# EAGLE board main (EAGLE 5.11)
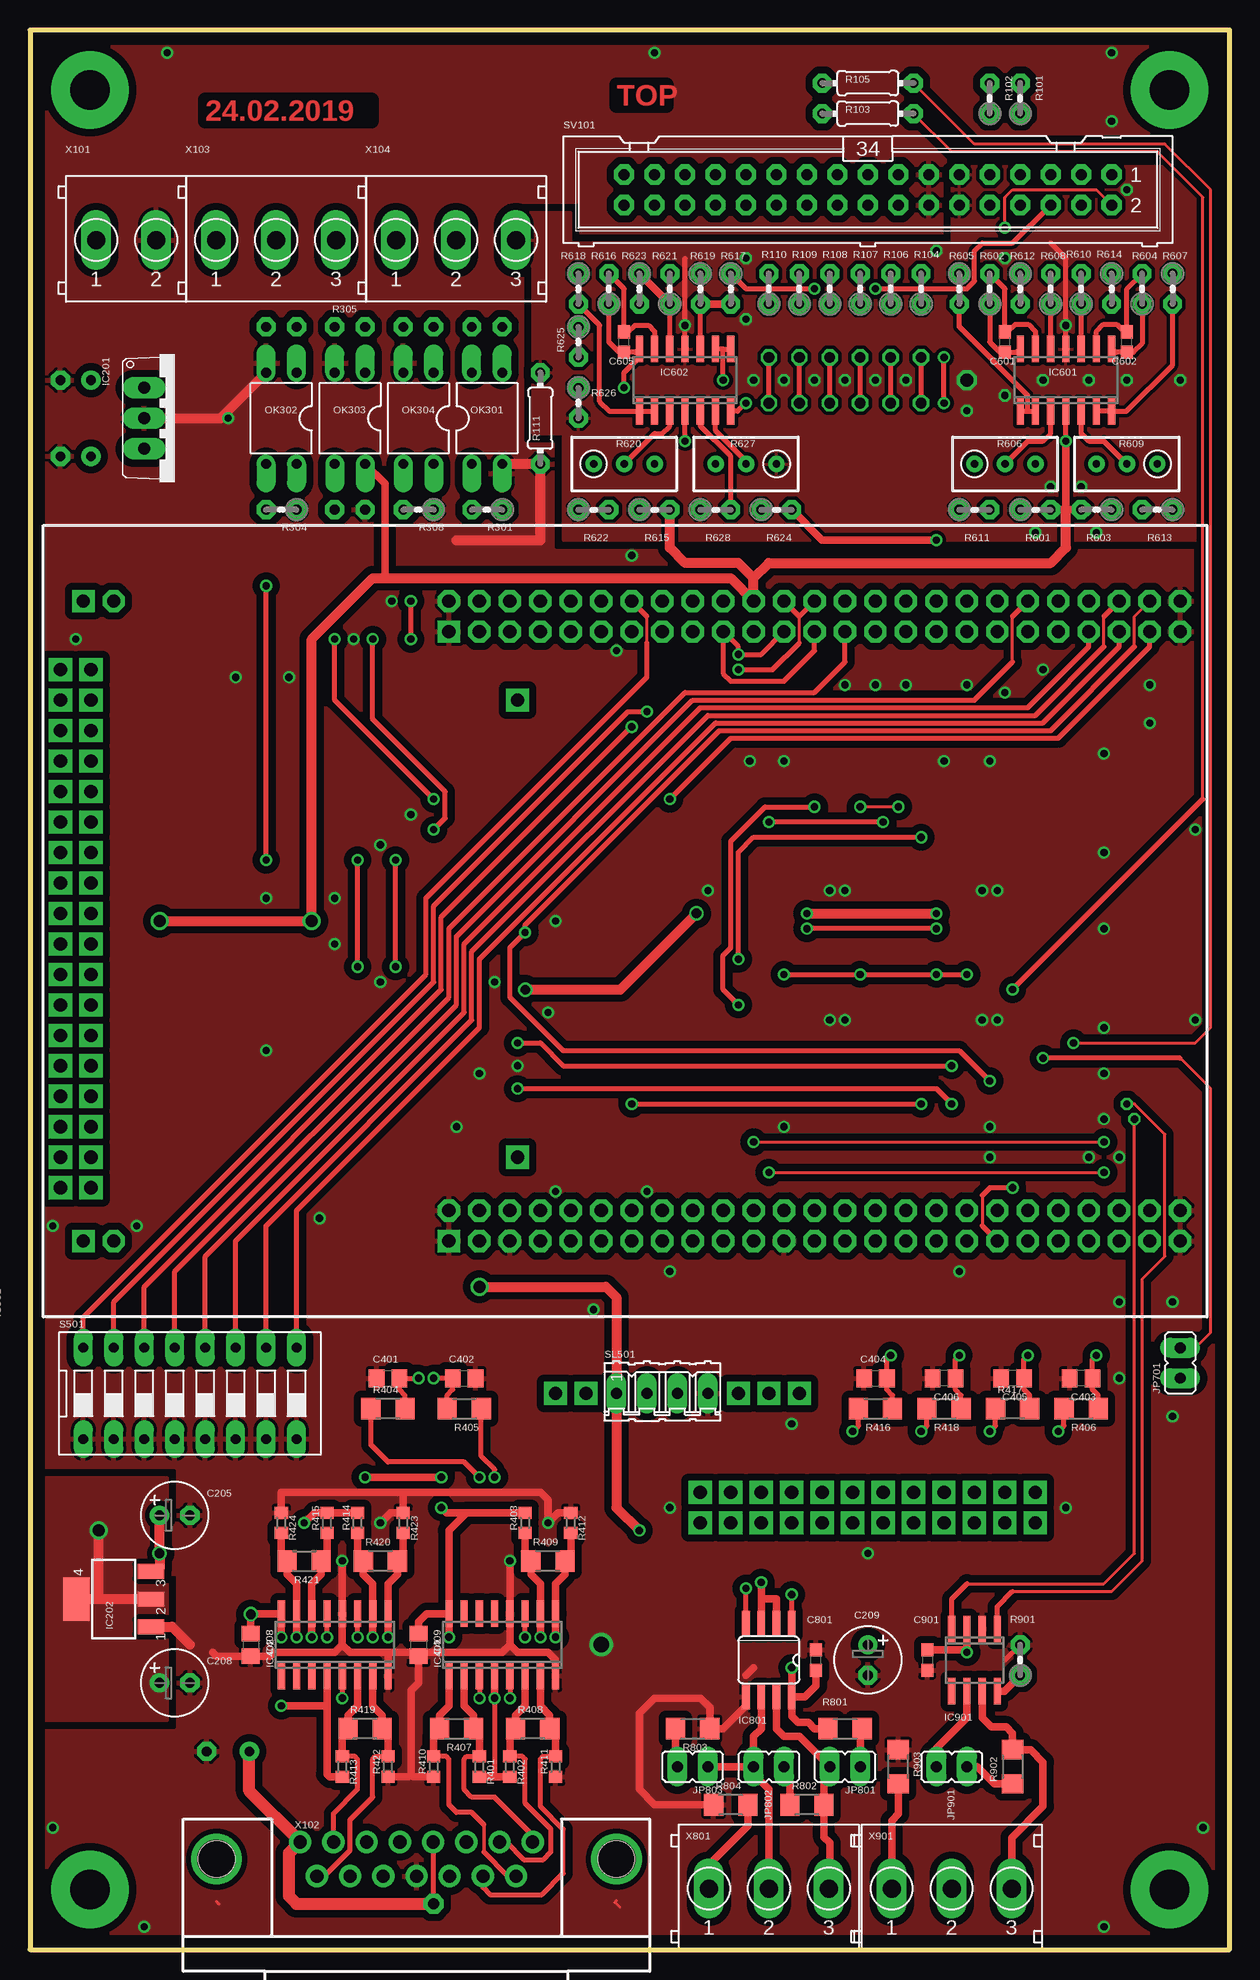
[diagram p9: board, top side]
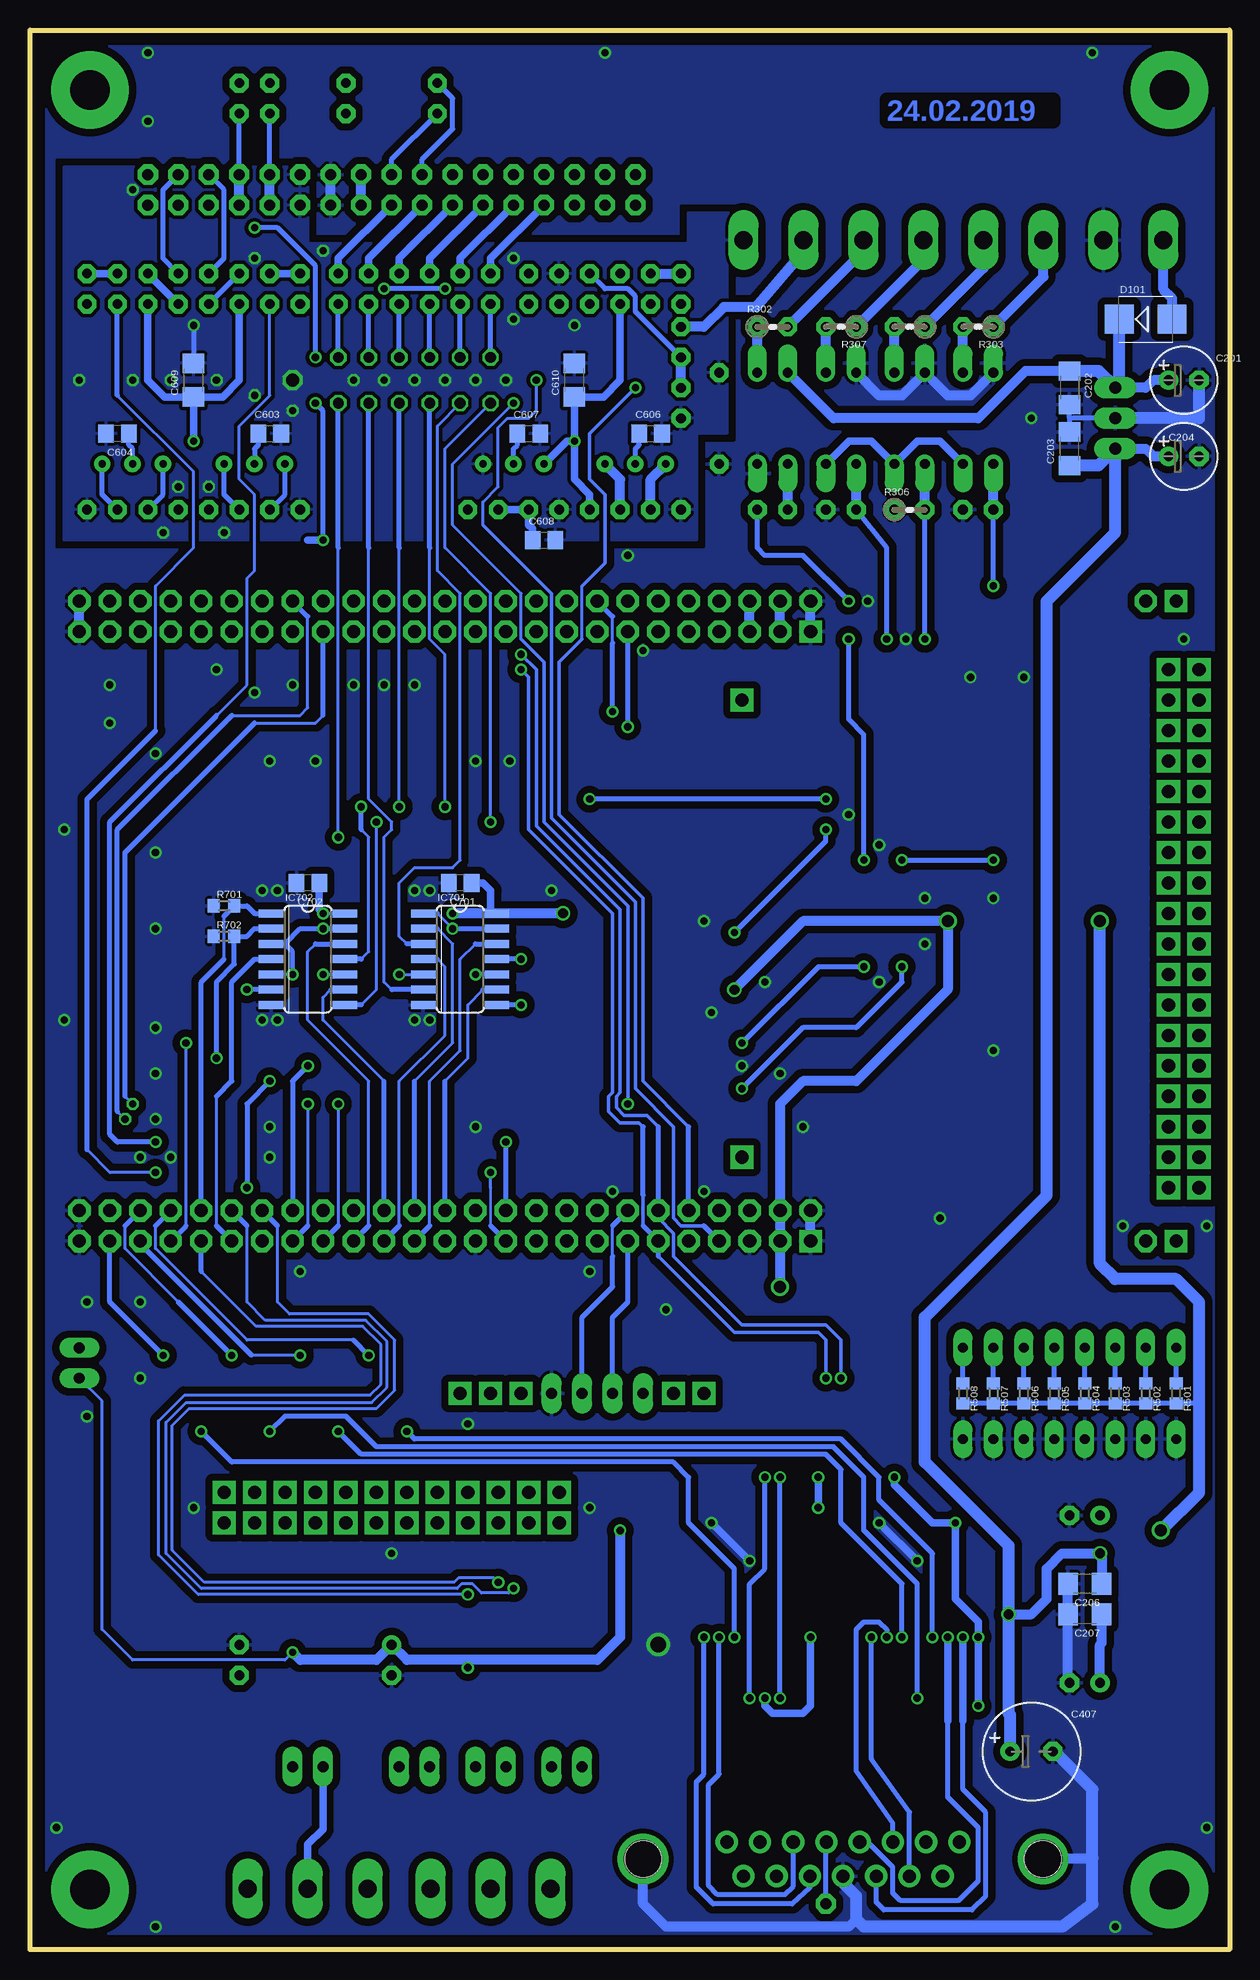
[diagram p10: board, bottom side, seen from below]

Size 100 x 160 mm. Coordinates in mm from the lower left corner, seen from the top.
Outline: 0,0 100,0 100,160 0,160 0,0
Copper layers (1*2*16): Top 0.035mm / dielectric 1.5mm / Route2 0.035mm / dielectric 0.15mm / Bottom 0.035mm
Design rules "default *": minimum track width 8mil, minimum drill 0.6mm, track to track 8mil, track to pad 8mil, pad to pad 8mil, via to via 8mil, smd to smd 8mil, copper to edge 40mil, drill to drill 8mil, minimum pad ring 15mil, minimum via ring 8mil, stop-mask expansion 4mil, vias tented up to drill 0mil, thermal gap 10mil

## Footprints (pad centres in the part's own frame; a part is rotated, then mirrored left to right if it is on the bottom)
E2,5-6 = drill 0.813 pad 1.6 round: + -1.27,0 | drill 0.813 pad 1.6 octagon: - 1.27,0
C1206 = smd 1.6 x 1.8: 1 -1.4,0; 2 1.4,0
C0805 = smd 1.3 x 1.5: 1 -0.95,0; 2 0.95,0
E3,5-8 = drill 0.813 pad 1.6 round: + -1.778,0 | drill 0.813 pad 1.6 octagon: - 1.778,0
C0603 = smd 1.1 x 1: 1 -0.85,0; 2 0.85,0
SMB = smd 2.4 x 2.4: A 2.2,0; C -2.2,0
TO220V = drill 1.016 long: 1 -2.54,-2.54; 2 0,-2.54; 3 2.54,-2.54
SOT223 = smd 1.219 x 2.235: 1 -2.311,-3.099; 2 0,-3.099; 3 2.311,-3.099 | smd 3.6 x 2.2: 4 0,3.099
SO16 = smd 0.6 x 2.2: 1 -4.445,-2.6; 2 -3.175,-2.6; 3 -1.905,-2.6; 4 -0.635,-2.6; 5 0.635,-2.6; 6 1.905,-2.6; 7 3.175,-2.6; 8 4.445,-2.6; 9 4.445,2.6; 10 3.175,2.6; 11 1.905,2.6; 12 0.635,2.6; 13 -0.635,2.6; 14 -1.905,2.6; 15 -3.175,2.6; 16 -4.445,2.6
STM32F4-DISCOVERY = drill 1.1 square: P1.1 -26.67,15.24; P2.1 24.13,15.24; P$101 -26.67,45.72; P$103 26.67,45.72 | drill 1.1 octagon: P1.2 -24.13,15.24; P1.3 -26.67,12.7; P1.4 -24.13,12.7; P1.5 -26.67,10.16; P1.6 -24.13,10.16; P1.7 -26.67,7.62; P1.8 -24.13,7.62; P1.9 -26.67,5.08; P1.10 -24.13,5.08; P1.11 -26.67,2.54; P1.12 -24.13,2.54; P1.13 -26.67,0; P1.14 -24.13,0; P1.15 -26.67,-2.54; P1.16 -24.13,-2.54; P1.17 -26.67,-5.08; P1.18 -24.13,-5.08; P1.19 -26.67,-7.62; P1.20 -24.13,-7.62; P1.21 -26.67,-10.16; P1.22 -24.13,-10.16; P1.23 -26.67,-12.7; P1.24 -24.13,-12.7; P1.25 -26.67,-15.24; P1.26 -24.13,-15.24; P1.27 -26.67,-17.78; P1.28 -24.13,-17.78; P1.29 -26.67,-20.32; P1.30 -24.13,-20.32; P1.31 -26.67,-22.86; P1.32 -24.13,-22.86; P1.33 -26.67,-25.4; P1.34 -24.13,-25.4; P1.35 -26.67,-27.94; P1.36 -24.13,-27.94; P1.37 -26.67,-30.48; P1.38 -24.13,-30.48; P1.39 -26.67,-33.02; P1.40 -24.13,-33.02; P1.41 -26.67,-35.56; P1.42 -24.13,-35.56; P1.43 -26.67,-38.1; P1.44 -24.13,-38.1; P1.45 -26.67,-40.64; P1.46 -24.13,-40.64; P1.47 -26.67,-43.18; P1.48 -24.13,-43.18; P1.49 -26.67,-45.72; P1.50 -24.13,-45.72; P2.2 26.67,15.24; P2.3 24.13,12.7; P2.4 26.67,12.7; P2.5 24.13,10.16; P2.6 26.67,10.16; P2.7 24.13,7.62; P2.8 26.67,7.62; P2.9 24.13,5.08; P2.10 26.67,5.08; P2.11 24.13,2.54; P2.12 26.67,2.54; P2.13 24.13,0; P2.14 26.67,0; P2.15 24.13,-2.54; P2.16 26.67,-2.54; P2.17 24.13,-5.08; P2.18 26.67,-5.08; P2.19 24.13,-7.62; P2.20 26.67,-7.62; P2.21 24.13,-10.16; P2.22 26.67,-10.16; P2.23 24.13,-12.7; P2.24 26.67,-12.7; P2.25 24.13,-15.24; P2.26 26.67,-15.24; P2.27 24.13,-17.78; P2.28 26.67,-17.78; P2.29 24.13,-20.32; P2.30 26.67,-20.32; P2.31 24.13,-22.86; P2.32 26.67,-22.86; P2.33 24.13,-25.4; P2.34 26.67,-25.4; P2.35 24.13,-27.94; P2.36 26.67,-27.94; P2.37 24.13,-30.48; P2.38 26.67,-30.48; P2.39 24.13,-33.02; P2.40 26.67,-33.02; P2.41 24.13,-35.56; P2.42 26.67,-35.56; P2.43 24.13,-38.1; P2.44 26.67,-38.1; P2.45 24.13,-40.64; P2.46 26.67,-40.64; P2.47 24.13,-43.18; P2.48 26.67,-43.18; P2.49 24.13,-45.72; P2.50 26.67,-45.72; P$102 -26.67,43.18; P$104 26.67,43.18
SO14 = smd 0.6 x 2.2: 1 -3.81,-2.6; 2 -2.54,-2.6; 3 -1.27,-2.6; 4 0,-2.6; 5 1.27,-2.6; 6 2.54,-2.6; 7 3.81,-2.6; 8 3.81,2.6; 9 2.54,2.6; 10 1.27,2.6; 11 0,2.6; 12 -1.27,2.6; 13 -2.54,2.6; 14 -3.81,2.6
SO14' = smd 0.66 x 2.032: 1 -3.81,-3.073; 2 -2.54,-3.073; 3 -1.27,-3.073; 4 0,-3.073; 5 1.27,-3.073; 6 2.54,-3.073; 7 3.81,-3.073; 8 3.81,3.073; 9 2.54,3.073; 10 1.27,3.073; 11 0,3.073; 12 -1.27,3.073; 13 -2.54,3.073; 14 -3.81,3.073
SO08 = smd 0.66 x 2.032: 1 -1.905,-3.073; 2 -0.635,-3.073; 3 0.635,-3.073; 4 1.905,-3.073; 5 1.905,3.073; 6 0.635,3.073; 7 -0.635,3.073; 8 -1.905,3.073
SO08' = smd 0.6 x 2.2: 1 -1.905,-2.6; 2 -0.635,-2.6; 3 0.635,-2.6; 4 1.905,-2.6; 5 1.905,2.6; 6 0.635,2.6; 7 -0.635,2.6; 8 -1.905,2.6
JP1 = drill 0.914 long: 1 0,-1.27; 2 0,1.27
DIL04 = drill 0.813 offset: 1 -1.27,-3.81; 2 1.27,-3.81; 3 1.27,3.81; 4 -1.27,3.81
0204V = drill 0.813 octagon: 1 -1.27,0; 2 1.27,0
0204/7 = drill 0.813 octagon: 1 -3.81,0; 2 3.81,0
R0603 = smd 1 x 1.1: 1 -0.85,0; 2 0.85,0
R1206 = smd 1.6 x 1.803: 1 -1.422,0; 2 1.422,0
RTRIM3296W = drill 0.61 round: 1 0,-2.54; 2 0,0; 3 0,2.54
DS-08 = drill 0.813 long: 1 -8.89,-3.81; 2 -6.35,-3.81; 3 -3.81,-3.81; 4 -1.27,-3.81; 5 1.27,-3.81; 6 3.81,-3.81; 7 6.35,-3.81; 8 8.89,-3.81; 9 8.89,3.81; 10 6.35,3.81; 11 3.81,3.81; 12 1.27,3.81; 13 -1.27,3.81; 14 -3.81,3.81; 15 -6.35,3.81; 16 -8.89,3.81
04P = drill 0.914 long: 1 -3.81,0; 2 -1.27,0; 3 1.27,0; 4 3.81,0
ML34 = drill 0.914 octagon: 1 -20.32,-1.27; 2 -20.32,1.27; 3 -17.78,-1.27; 4 -17.78,1.27; 5 -15.24,-1.27; 6 -15.24,1.27; 7 -12.7,-1.27; 8 -12.7,1.27; 9 -10.16,-1.27; 10 -10.16,1.27; 11 -7.62,-1.27; 12 -7.62,1.27; 13 -5.08,-1.27; 14 -5.08,1.27; 15 -2.54,-1.27; 16 -2.54,1.27; 17 0,-1.27; 18 0,1.27; 19 2.54,-1.27; 20 2.54,1.27; 21 5.08,-1.27; 22 5.08,1.27; 23 7.62,-1.27; 24 7.62,1.27; 25 10.16,-1.27; 26 10.16,1.27; 27 12.7,-1.27; 28 12.7,1.27; 29 15.24,-1.27; 30 15.24,1.27; 31 17.78,-1.27; 32 17.78,1.27; 33 20.32,-1.27; 34 20.32,1.27
TS-502-2P = drill 1.5 pad 2.5 long: P$1 -2.5,0; P$2 2.5,0
H5R15RA = drill 1.092 round: 1 9.69,1.422; 2 6.921,1.422; 3 4.153,1.422; 4 1.384,1.422; 5 -1.384,1.422; 6 -4.153,1.422; 7 -6.921,1.422; 8 -9.69,1.422; 9 8.306,-1.422; 10 5.537,-1.422; 11 2.769,-1.422; 12 0,-1.422; 13 -2.769,-1.422; 14 -5.537,-1.422; 15 -8.306,-1.422 | hole 3.048: -16.662,0; 16.662,0
TS-502-3P = drill 1.5 pad 2.5 long: P$1 -5,0; P$2 0,0; P$3 5,0

## Placement (x,y rotation side)
C201  [E2,5-6]  3.81,130.81 0 bottom
C202  100nF  [C1206]  13.34,130.18 270 bottom
C203  100nF  [C1206]  13.34,125.09 90 bottom
C204  [E2,5-6]  3.81,124.46 0 bottom
C205  [E2,5-6]  12.06,36.2 0 top
C206  100nF  [C1206]  12.06,30.48 180 bottom
C207  100nF  [C1206]  12.06,27.94 180 bottom
C208  [E2,5-6]  12.06,22.23 0 top
C209  [E2,5-6]  69.85,24.13 270 top
C401  *  [C0805]  29.84,47.62 0 top
C402  *  [C0805]  36.2,47.62 0 top
C403  *  [C0805]  87.63,47.62 180 top
C404  *  [C0805]  70.48,47.62 0 top
C405  *  [C0805]  81.92,47.62 180 top
C406  *  [C0805]  76.2,47.62 180 top
C407  [E3,5-8]  16.51,16.51 0 bottom
C408  100nF  [C0805]  18.41,25.4 270 top
C409  100nF  [C0805]  32.38,25.4 270 top
C601  10pF*  [C0603]  81.28,133.99 90 top
C602  10pF*  [C0603]  91.44,133.99 90 top
C603  100nF  [C0805]  80.01,126.36 0 bottom
C604  100nF  [C0805]  92.71,126.36 180 bottom
C605  10pF*  [C0603]  49.53,133.99 90 top
C606  100nF  [C0805]  48.26,126.36 0 bottom
C607  100nF  [C0805]  58.42,126.36 0 bottom
C608  100nF  [C0805]  57.15,117.47 0 bottom
C609  100nF  [C1206]  86.36,130.81 90 bottom
C610  100nF  [C1206]  54.61,130.81 90 bottom
C701  100nF  [C0805]  64.14,88.9 180 bottom
C702  100nF  [C0805]  76.83,88.9 180 bottom
C801  100nF  [C0603]  65.53,24.13 90 top
C901  100nF  [C0603]  74.8,24.13 270 top
D101  [SMB]  6.99,135.89 0 bottom
IC201  AMSR-78XX- NZ  [TO220V]  12.06,127.64 270 top
IC202  [SOT223]  6.99,29.21 90 top
IC401  ISL32173EFBZ  [SO16]  39.37,25.4 0 top
IC402  ISL32173EFBZ  [SO16]  25.4,25.4 0 top
IC501  [STM32F4-DISCOVERY]  50.16,85.72 90 top
IC601  MCP604SL  [SO14]  86.36,130.81 0 top
IC602  MCP604SL  [SO14]  54.61,130.81 0 top
IC701  74HCT08D  [SO14']  64.14,82.55 270 bottom
IC702  74HCT08D  [SO14']  76.83,82.55 270 bottom
IC801  MAX3468CSA  [SO08]  61.59,24.13 180 top
IC901  SN65HVD230D  [SO08']  78.74,24.13 180 top
JP701  [JP1]  95.89,48.9 0 top
JP801  [JP1]  67.94,15.24 90 top
JP802  [JP1]  61.59,15.24 90 top
JP803  [JP1]  55.24,15.24 90 top
JP901  [JP1]  76.83,15.24 90 top
OK301  PC817  [DIL04]  38.1,127.64 0 top
OK302  PC817  [DIL04]  20.95,127.64 180 top
OK303  PC817  [DIL04]  26.67,127.64 180 top
OK304  PC817  [DIL04]  32.38,127.64 180 top
R101  NA  [0204V]  82.55,154.31 90 top
R102  NA  [0204V]  80.01,154.31 90 top
R103  0R0  [0204/7]  69.85,153.03 0 top
R104  165*  [0204V]  74.3,138.43 90 top
R105  0R0  [0204/7]  69.85,155.57 0 top
R106  165*  [0204V]  71.75,138.43 90 top
R107  165*  [0204V]  69.22,138.43 90 top
R108  165*  [0204V]  66.67,138.43 90 top
R109  165*  [0204V]  64.14,138.43 90 top
R110  165*  [0204V]  61.59,138.43 90 top
R111  0R0  [0204/7]  42.55,127.64 90 top
R301  3.3K  [0204V]  38.1,120.02 180 top
R302  120  [0204V]  38.1,135.25 0 bottom
R303  6.2K  [0204V]  20.95,135.25 180 bottom
R304  3.3K  [0204V]  20.95,120.02 180 top
R305  6.2K  [0204V]  26.67,135.25 180 bottom
R306  3.3K  [0204V]  26.67,120.02 0 bottom
R307  6.2K  [0204V]  32.38,135.25 180 bottom
R308  3.3K  [0204V]  32.38,120.02 180 top
R401  5.1K  [R0603]  37.47,15.24 270 top
R402  5.1K  [R0603]  40.01,15.24 270 top
R403  5.1K  [R0603]  41.27,35.56 90 top
R404  *  [R1206]  29.84,45.09 0 top
R405  *  [R1206]  36.2,45.09 180 top
R406  *  [R1206]  87.63,45.09 180 top
R407  120  [R1206]  35.56,18.41 180 top
R408  120  [R1206]  41.91,18.41 0 top
R409  120  [R1206]  43.18,32.38 0 top
R410  5.1K  [R0603]  33.66,15.24 90 top
R411  5.1K  [R0603]  43.81,15.24 90 top
R412  5.1K  [R0603]  45.09,35.56 270 top
R413  5.1K  [R0603]  26.04,15.24 270 top
R414  5.1K  [R0603]  27.3,35.56 90 top
R415  5.1K  [R0603]  24.77,35.56 90 top
R416  *  [R1206]  70.48,45.09 180 top
R417  *  [R1206]  81.92,45.09 0 top
R418  *  [R1206]  76.2,45.09 180 top
R419  120  [R1206]  27.94,18.41 0 top
R420  120  [R1206]  29.21,32.38 0 top
R421  120  [R1206]  22.86,32.38 180 top
R422  5.1K  [R0603]  29.84,15.24 90 top
R423  5.1K  [R0603]  31.11,35.56 270 top
R424  5.1K  [R0603]  20.95,35.56 270 top
R501  10K  [R0603]  4.45,46.35 270 bottom
R502  10K  [R0603]  6.99,46.35 270 bottom
R503  10K  [R0603]  9.53,46.35 270 bottom
R504  10K  [R0603]  12.06,46.35 270 bottom
R505  10K  [R0603]  14.61,46.35 270 bottom
R506  10K  [R0603]  17.14,46.35 270 bottom
R507  10K  [R0603]  19.68,46.35 270 bottom
R508  10K  [R0603]  22.23,46.35 270 bottom
R601  1.5K  [0204V]  83.82,120.02 0 top
R602  3.3K  [0204V]  80.01,138.43 90 top
R603  1.5K  [0204V]  88.9,120.02 180 top
R604  3.3K  [0204V]  92.71,138.43 90 top
R605  3.3K  [0204V]  77.47,138.43 270 top
R606  500  [RTRIM3296W]  81.28,123.83 270 top
R607  3.3K  [0204V]  95.25,138.43 270 top
R608  3.3K  [0204V]  85.09,138.43 90 top
R609  500  [RTRIM3296W]  91.44,123.83 90 top
R610  3.3K  [0204V]  87.63,138.43 90 top
R611  1.5K  [0204V]  78.74,120.02 0 top
R612  3.3K  [0204V]  82.55,138.43 270 top
R613  1.5K  [0204V]  93.98,120.02 180 top
R614  3.3K  [0204V]  90.17,138.43 270 top
R615  1.5K  [0204V]  52.07,120.02 0 top
R616  51K  [0204V]  48.26,138.43 90 top
R617  0R0 (7.6K*)  [0204V]  58.42,138.43 270 top
R618  51K  [0204V]  45.72,138.43 270 top
R619  2.7K  [0204V]  55.88,138.43 270 top
R620  500  [RTRIM3296W]  49.53,123.83 270 top
R621  51K  [0204V]  53.34,138.43 90 top
R622  1.5K  [0204V]  46.99,120.02 0 top
R623  51K*  [0204V]  50.8,138.43 270 top
R624  10K  [0204V]  62.23,120.02 0 top
R625  6.2K*  [0204V]  45.72,133.99 270 top
R626  1.1K*  [0204V]  45.72,128.91 270 top
R627  5K  [RTRIM3296W]  59.69,123.83 90 top
R628  2.7K  [0204V]  57.15,120.02 0 top
R701  10K  [R0603]  83.82,87 0 bottom
R702  10K  [R0603]  83.82,84.45 0 bottom
R801  560  [R1206]  67.94,18.41 180 top
R802  120  [R1206]  64.77,12.06 0 top
R803  560  [R1206]  55.24,18.41 180 top
R804  120  [R1206]  58.42,12.06 0 top
R901  4.7K*  [0204V]  82.55,24.13 90 top
R902  120  [R1206]  81.92,15.24 90 top
R903  120  [R1206]  72.39,15.24 270 top
S501  [DS-08]  13.34,46.35 0 top
SL501  [04P]  52.7,46.35 0 top
SV101  [ML34]  69.85,146.69 180 top
X101  [TS-502-2P]  8.02,142.49 0 top
X102  D-SUB15-H5R15RA  [H5R15RA]  32.22,7.54 0 top
X103  [TS-502-3P]  20.52,142.49 0 top
X104  [TS-502-3P]  35.52,142.49 0 top
X801  [TS-502-3P]  61.59,5.08 0 top
X901  [TS-502-3P]  76.83,5.08 0 top

## Tracks (layer width: path | path; a pad name or v marks a point on that pad's centre or on a via)
+3V3  (via drill 0.6, 0.8, 1)
  Top 0.406: v86.36,125.73 IC601.4 | v54.61,125.73 IC602.4
  Top 0.61: 86.36,120.02 R601.2 | 86.36,120.02 R603.2 | 86.36,120.02 v86.36,125.73 | OK303.4 29.59,122.17 29.59,114.3 | IC801.8 64.62,21.06 65.53,21.97 C801.1 | R801.2 65.41,18.41 64.9,18.92 64.01,18.92 63.5,19.43 IC801.8 | C901.1 77.89,24.98 v78.11,24.77 IC901.3 | v63.5,23.5 IC801.8
  Top 0.813: 60.33,114.3 IC501.P2.22 58.42,114.3 29.59,114.3 28.57,114.3 23.5,109.22 v23.5,85.72 v10.79,85.72 | 60.33,114.3 61.59,115.57 85.09,115.57 86.36,116.84 86.36,120.02 | 60.33,114.3 59.05,115.57 54.61,115.57 53.34,116.84 R615.2 | v41.27,80.01 49.21,80.01 v55.56,86.36 | v64.77,86.36 v75.56,86.36 | v50.8,34.92 48.9,36.83 SL501.1 48.9,54.36 48.01,55.24 v37.47,55.24 | IC202.4 5.71,29.21 | 5.71,29.21 IC202.2 | 5.71,29.21 v5.71,34.92
  Bottom 0.254: v75.56,86.36 IC702.14 | JP701.1 93.98,45.72 93.98,26.67 91.44,24.13 78.74,24.13 v78.11,24.77
  Bottom 0.406: R508.2 R507.2 R506.2 R505.2 R504.2 R503.2 R502.2 R501.2 2.75,45.51 2.54,45.72
  Bottom 0.61: v86.36,125.73 C609.1 | OK302.4 24.13,125.73 26.04,125.73 OK303.4 29.84,125.73 31.75,125.73 OK304.4 | v54.61,125.73 C610.1 52.2,129.41 50.8,130.81 R623.2 | R615.2 53.34,121.28 54.61,122.56 v54.61,125.73 | v54.61,125.73 55.24,125.73 R627.3 | R612.2 82.55,130.81 83.95,129.41 C609.1 | R614.2 90.17,130.81 88.77,129.41 C609.1 | C702.1 75.89,86.68 v75.56,86.36 | C701.1 62.23,88.9 61.59,88.27 61.59,86.36
  Bottom 0.813: v50.8,34.92 50.8,26.04 52.7,24.13 63.5,24.13 | 63.5,24.13 v63.5,23.5 | v78.11,24.77 77.47,24.13 71.12,24.13 C209.+ 68.58,24.13 63.5,24.13 | C207.1 10.66,25.53 10.79,25.4 C208.+ | v64.77,86.36 61.59,86.36 IC701.14 v55.56,86.36 | v41.27,80.01 35.56,85.72 v23.5,85.72 23.5,80.01 31.11,72.39 35.56,72.39 37.47,70.48 IC501.P1.4 IC501.P1.3 v37.47,55.24
  Bottom 1.016: v5.71,34.92 2.54,38.1 2.54,45.72 2.54,53.98 4.45,55.88 9.53,55.88 10.79,57.15 v10.79,85.72
  pour Top (isolate 0.406, no thermals): 11.43,19.05 1.27,19.05 1.27,39.37 11.43,39.37
+5V  (via drill 0.6, 0.8, 0.9 pad 1.68)
  Top 0.406: v33.66,3.81 33.66,8.91 | v38.73,20.95 38.73,14.39
  Top 0.61: R414.2 R415.2 23.71,36.41 v22.86,35.56 | R401.2 38.73,14.39 R402.2 | R413.2 24.98,14.39 24.77,14.61 24.77,20.32 | 24.77,20.32 IC402.4 | v20.95,26.04 IC402.16 18.48,28 v18.41,27.94 C408.1 | IC401.16 34.92,34.92 36.41,36.41 R403.2 34.71,36.41 v34.29,36.83 | C409.1 32.38,27.3 33.08,28 IC401.16 | v38.73,20.95 IC401.4 | IC401.16 v34.92,26.04 | v20.95,20.32 24.77,20.32 | v27.94,39.37 v34.29,39.37
  Top 0.813: IC202.3 10.57,31.52 10.79,31.75 v10.79,33.02 C205.+
  Top 1.016: v33.66,3.81 22.23,3.81 21.59,4.45 21.59,8.02 X102.8 18.29,13.2 C407.+
  Bottom 0.406: v33.66,3.81 33.66,8.91 X102.4
  Bottom 0.61: v20.95,20.32 v20.95,26.04 20.95,27.3 22.86,29.21 v22.86,35.56 24.77,35.56 27.94,38.73 v27.94,39.37 | v38.73,20.95 38.73,20.32 38.1,19.68 35.56,19.68 34.92,20.32 v34.92,26.04 | v34.29,39.37 v34.29,36.83
  Bottom 0.813: C204.+ 6.35,124.46 6.99,125.09 IC201.3 | C206.1 10.66,32.89 v10.79,33.02 13.97,33.02 15.24,31.75 15.24,29.21 16.51,27.94 v18.41,27.94 18.41,32.38
  Bottom 1.016: C407.+ 18.29,19.56 18.41,19.68 v18.41,27.94 18.41,33.66 25.4,40.64 25.4,52.7 15.24,62.87 15.24,112.39 9.53,118.11 IC201.3 10.93,123.69 C203.1
+12V_OR_+5V
  Bottom 0.813: SV101.16 SV101.15
+15V
  Bottom 0.406: SV101.9 R102.1
  Bottom 0.813: SV101.10 SV101.9
+24V
  Bottom 0.813: OK301.4 33.02,127.64 20.95,127.64 17.02,131.57 C202.1 | C201.+ 6.35,130.81 6.99,130.18 IC201.1
  Bottom 1.016: C202.1 10.93,131.57 IC201.1 9.19,130.51 D101.C
-15V
  Bottom 0.406: SV101.7 R101.1
  Bottom 0.813: SV101.8 SV101.7
A
  Top 0.406: X102.1 41.91,9.53 38.73,12.7 36.83,12.7 36.2,13.34 36.2,15.88 36.41,16.09 R401.1
  Top 0.61: R401.1 37.47,17.93 R407.1 36.98,19.53 36.2,20.32 IC401.2
AGND  (via drill 0.6, 1.1)
  Top 0.305: IC602.11 54.61,132.72
  Top 0.406: 85.09,142.24 86.36,140.97 v86.36,135.38 IC601.11 | 54.61,140.97 v54.61,135.38 IC602.11
  Bottom 0.406: v86.36,135.38 C609.2
  other vias: 81.28,140.97 75.56,141.6 91.44,130.81 59.69,140.97 59.69,135.89 62.87,130.81 65.41,130.81 67.94,130.81 70.48,130.81 73.03,130.81 60.33,130.81 78.11,130.81 91.44,146.69 83.82,118.11 88.9,118.11 88.27,130.81 81.28,129.54 84.45,130.81 78.11,128.27 87.63,121.92 85.09,121.92 95.89,130.81
  pour Bottom (isolate 0.305): 41.91,126.36 44.45,126.36 44.45,117.47 97.16,117.47 97.16,148.59 76.83,148.59 76.83,142.24 45.09,142.24 45.09,144.78 40.01,144.78 40.01,140.34 41.91,140.34
  pour Top (isolate 0.305): 41.91,126.36 44.45,126.36 44.45,117.47 97.16,117.47 97.16,148.59 76.83,148.59 76.83,142.24 45.09,142.24 45.09,144.78 40.01,144.78 40.01,140.34 41.91,140.34
AIN0
  Bottom 0.813: X104.P$2 35.52,141.52 39.5,136.91 42.16,136.91 43.81,135.25 R625.1
AN
  Top 0.305: 37.85,8.13 37.85,10.41
  Top 0.406: X102.9 39.86,6.12 37.85,8.13 | 37.85,10.41 36.83,11.43 35.56,11.43 34.92,12.06 34.92,15.88 34.71,16.09 R410.2
  Top 0.61: R410.2 33.66,17.93 R407.2 34.14,19.53 34.92,20.32 IC401.1
B
  Top 0.406: X102.2 39.68,8.96 41.15,7.49 42.8,7.49 43.43,8.13 43.43,10.03 41.27,12.19 41.27,15.88 41.06,16.09 R402.1
  Top 0.61: R402.1 40.01,17.93 R408.1 40.49,19.53 41.27,20.32 IC401.6
BN
  Top 0.406: X102.10 37.76,5.17 38.35,4.57 42.67,4.57 44.45,6.35 44.45,10.03 42.55,11.94 42.55,15.88 42.76,16.09 R411.2
  Top 0.61: R411.2 43.81,17.93 R408.2 43.33,19.53 42.55,20.32 IC401.7
BR_RESISTOR
  Bottom 0.406: SV101.17 69.85,149.22 R103.1
CAN1_RX  (via drill 0.6)
  Top 0.254: 78.11,30.48 89.53,30.48 92.08,33.02 v92.08,69.22
  Top 0.406: 78.11,30.48 76.83,29.21 IC901.4
  Bottom 0.254: 76.83,111.12 76.83,103.5 77.47,102.87 83.19,102.87 | v92.08,69.22 92.71,69.85
  Bottom 0.406: 76.83,111.12 IC501.P2.36 | 83.19,102.87 92.71,93.34 92.71,69.85
CAN1_TX  (via drill 0.6)
  Top 0.254: 81.92,29.84 90.17,29.84 92.71,32.38 92.71,55.88 94.61,57.78 94.61,67.94 92.08,70.48 v91.44,70.48
  Top 0.406: 81.92,29.84 80.64,28.57 IC901.1
  Bottom 0.254: 75.56,102.87 76.2,102.23 81.28,102.23 | v91.44,70.48 92.08,71.12
  Bottom 0.406: 75.56,102.87 IC501.P2.33 | 81.28,102.23 92.08,91.44 92.08,71.12
CHARGE_RELAY
  Bottom 0.406: SV101.19 67.31,149.22 64.77,151.76 64.77,154.31 R105.1
CURRENT_A
  Bottom 0.406: SV101.5 83.82,146.69 83.82,140.97 R608.2
CURRENT_A_MCU  (via drill 0.6)
  Top 0.254: v60.33,67.31 v89.53,67.31
  Top 0.406: R602.1 80.01,133.99 80.86,133.13 C601.1 82.16,133.13 IC601.14
  Bottom 0.254: 84.45,102.87 81.92,105.41 81.92,114.3 81.28,114.94 81.28,121.28 82.55,122.56 82.55,127 80.01,129.54 R602.1
  Bottom 0.406: IC501.P1.22 v60.33,67.31 | v89.53,67.31 92.71,67.31 93.34,67.94 93.34,93.98 84.45,102.87
CURRENT_B
  Bottom 0.406: SV101.3 88.9,146.69 88.9,140.97 R610.2
CURRENT_B_MCU  (via drill 0.6)
  Top 0.254: v61.59,64.77 v89.53,64.77
  Top 0.406: IC601.8 90.56,133.13 C602.1 91.99,133.13 92.71,133.86 R604.1
  Bottom 0.203: 61.59,60.33 61.59,63.5
  Bottom 0.254: 61.59,63.5 v61.59,64.77 | 89.53,101.6 89.53,113.67 86.36,116.84 86.36,123.19 92.71,129.54 | v89.53,64.77 93.34,64.77 95.25,66.67
  Bottom 0.406: IC501.P1.21 61.59,60.33 | 89.53,101.6 95.25,95.89 95.25,66.67 | 92.71,129.54 R604.1
CURRENT_MOTOR  (via drill 0.6)
  Top 0.254: v81.28,143.51 81.28,146.05 81.92,146.69 88.9,146.69 SV101.2
  Top 0.406: v76.2,128.91 v76.2,132.72
  Top 0.61: R624.2 66.04,117.47 v75.56,117.47
  Bottom 0.406: v75.56,117.47 75.56,128.27 v76.2,128.91 | v76.2,132.72 76.2,140.34 79.38,143.51 v81.28,143.51
  Bottom 0.61: v75.56,117.47 76.83,117.47
DIR
  Bottom 0.813: X103.P$3 25.52,140.85 R307.1
DO0
  Bottom 0.813: X104.P$1 30.52,141.57 R302.2
EN
  Bottom 0.813: X103.P$1 15.52,139.42 R303.1
ENC_A  (via drill 0.6)
  Top 0.406: v32.38,47.62 C401.2 30.8,46.67 31.27,46.2 R404.2 | IC501.P2.23 60.96,107.95 v59.05,107.95 59.05,108.58 IC501.P2.19 57.78,106.36 58.42,105.73 62.87,105.73 65.41,108.27 IC501.P2.25
  Bottom 0.305: 47.62,60.96 46.35,59.69 46.35,57.78 40.64,52.07 33.66,52.07 32.38,50.8 v32.38,47.62 | 47.62,68.58 48.58,69.53 50.48,69.53 51.12,70.17 51.12,71.12 50.8,71.44 50.8,86.68 57.78,93.66 57.78,106.68 v59.05,107.95
  Bottom 0.406: 47.62,60.96 IC501.P1.12 47.62,68.58
ENC_B  (via drill 0.6)
  Top 0.254: 64.14,108.9 64.14,111.12
  Top 0.406: v33.66,47.62 C402.1 35.24,46.67 34.77,46.2 R405.2 | IC501.P2.24 64.14,111.12 IC501.P2.26 | 64.14,108.9 61.91,106.68 v59.05,106.68
  Bottom 0.305: v33.66,47.62 33.66,50.8 34.29,51.44 41.27,51.44 47.62,57.78 | 48.9,60.33 48.9,62.87 | 48.9,68.58 49.21,68.9 50.8,68.9 51.75,69.85 51.75,71.12 51.44,71.44 51.44,86.36 58.42,93.34 58.42,106.05 v59.05,106.68
  Bottom 0.406: 47.62,57.78 IC501.P1.11 48.9,60.33 | 48.9,62.87 48.9,68.58
GND  (via drill 0.6, 1.3, 3.2)
  Top 0.254: 15.54,4.01 15.75,3.81 | 48.9,4.06 48.77,3.94 49.15,3.56
  Top 0.406: 81.28,24.13 R901.2
  Top 0.61: IC801.5 59.69,20.32 57.78,18.41 R803.1 56.67,20.17 55.88,20.95 52.07,20.95 50.8,19.68 50.8,13.34 52.07,12.06 R804.1 | 59.69,22.86 60.33,23.5 | 31.11,38.1 20.95,38.1 R424.1 | R423.1 31.11,37.47 | R423.1 31.11,38.1 | 26.04,25.4 IC402.12 v26.04,32.38 | 26.04,25.4 26.67,24.77 29.84,24.77 | 26.04,25.4 25.4,24.77 20.32,24.77 20,24.45 C408.2 15.55,24.45 15.24,24.77 | R423.1 30.06,36.41 v29.21,35.56 | R412.1 44.03,36.41 v43.18,35.56 43.18,37.47 42.55,38.1 31.11,38.1 | v40.01,32.38 IC401.12 40.01,25.4 | 40.01,25.4 39.37,24.77 32.38,24.77 | IC401.8 43.81,24.13 43.18,24.77 40.64,24.77 40.01,25.4 | 29.84,24.77 32.38,24.77 | 32.38,24.77 C409.2 32.38,22.23 31.75,21.59 31.75,14.61 | 29.84,24.77 IC402.8 | R422.1 31.54,14.39 31.75,14.61 | R410.1 31.96,14.39 31.75,14.61
  Top 0.813: 35.56,117.47 42.55,117.47 R111.1 OK301.2 | IC201.2 15.88,127.64 OK302.2 | IC202.1 11.84,26.9 13.34,25.4
  Bottom 0.406: 13.34,127.64 C203.2 | 13.34,127.64 C202.2 | IC201.2 13.34,127.64
  Bottom 0.61: v26.04,32.38 v29.21,35.56 | v40.01,32.38 v43.18,35.56
  Bottom 0.813: IC501.P2.1 IC501.P2.2 | OK302.2 21.59,129.54 23.5,129.54 OK303.2 27.3,129.54 29.21,129.54 OK304.2 | SV101.14 SV101.13 | IC501.P2.49 IC501.P2.50 | IC501.P1.1 IC501.P1.2 | v15.54,7.54 11.51,7.54 11.43,7.62 | v48.9,7.54 48.9,3.81 46.99,1.91 31.75,1.91 31.11,2.54 | C208.- 13.46,22.36 C207.2 C206.2
  Bottom 1.016: C407.- 14.61,16.51 11.43,13.34 11.43,7.62 11.43,3.81 13.97,1.91 30.48,1.91 31.11,2.54 31.11,4.45 32.22,5.55 X102.12 | C201.- 2.54,127.64 IC201.2
  other vias: 47.62,25.4 9.53,1.91 97.79,10.16 11.43,158.12 90.17,158.12 52.07,158.12 60.01,99.06 19.68,87.63 3.81,109.22 19.68,74.93 35.56,68.58 95.25,53.98 95.25,44.45 48.9,108.27 93.34,105.41 24.13,60.96 56.52,88.27 38.73,80.64 51.44,63.18 43.81,63.18 62.87,68.58 70.48,105.41 73.03,105.41 78.11,105.41 84.45,106.68 93.34,102.23 89.53,99.69 67.94,105.41 76.2,99.06 80.01,99.06 81.28,104.78 80.01,68.58 80.01,66.04 88.27,66.04 90.81,66.04 79.38,77.47 66.67,77.47 67.94,77.47 80.64,77.47 80.64,88.27 79.38,88.27 67.94,88.27 66.67,88.27 97.16,93.34 97.16,77.47 89.53,76.83 89.53,85.09 89.53,91.44 89.53,69.22 89.53,73.03 43.81,85.72 43.18,78.11 29.21,80.64 40.64,73.66 30.16,112.39 29.21,92.08 31.75,94.61 26.99,109.22 21.59,106.05 17.14,106.05 16.51,127.64 50.16,116.2 90.17,152.4 89.53,1.91 1.91,10.16 69.85,33.02 63.5,43.81 90.81,47.62 77.47,56.52 53.34,56.52 46.99,53.34 90.81,53.98 86.36,36.83 53.34,36.83 8.89,60.33 1.91,60.33 25.4,83.82 25.4,87.63 37.47,73.03 62.87,99.06
  pour Top (isolate 0.61, rank 2): 0,160.02 99.69,160.02 100.33,160.02 100.33,0 0,0
  pour Bottom (isolate 0.61, rank 2): 0,0 100.33,0 100.33,160.02 0,160.02
MCU_AI0  (via drill 0.6)
  Top 0.406: v49.53,130.18 49.53,131.44 50.8,132.72 IC602.14 50.41,133.13 C605.1 49.11,133.13 48.26,133.99 R616.1
  Bottom 0.254: 53.98,109.22 53.98,113.67
  Bottom 0.305: 45.09,68.58 48.9,72.39 48.9,87.63 55.88,94.61 55.88,107.31 53.98,109.22 | 53.98,113.67 52.07,115.57 52.07,121.28 53.34,122.56 53.34,126.36 v49.53,130.18
  Bottom 0.406: IC501.P1.10 45.09,68.58
MCU_BR
  Bottom 0.254: 84.45,60.33 84.45,71.12
  Bottom 0.406: IC501.P1.39 84.45,60.33 | IC702.4 81.28,82.55 83.19,80.64 83.19,72.39 84.45,71.12
MCU_BR_OUT  (via drill 0.6)
  Top 0.254: 73.03,153.03 R103.2 76.83,149.86 93.98,149.86 97.79,146.05 97.79,95.89
  Top 0.406: v81.92,80.01 97.79,95.89
  Bottom 0.406: IC702.6 v81.92,80.01
MCU_CHARGE_RELAY  (via drill 0.6)
  Top 0.254: R105.2 78.74,150.5 94.61,150.5 98.42,146.69 98.42,76.83 97.16,75.56 v87,75.56
  Bottom 0.254: 87,60.33 v87,75.56
  Bottom 0.406: IC501.P1.43 87,60.33
MCU_DIR  (via drill 0.6, 0.61)
  Top 0.254: 79.38,62.87 79.38,60.33 | IC501.P2.48 92.08,111.12 92.08,108.58
  Top 0.406: v33.66,93.34 34.61,94.3 34.61,96.52 28.57,102.55 v28.57,109.22 | 79.38,60.33 IC501.P1.37 | 79.38,62.87 80.01,63.5 v81.92,63.5 | v80.01,72.39 77.47,74.93 44.45,74.93 40.01,79.38 40.01,83.5 v41.27,84.77 41.27,85.41 57.47,101.6 85.09,101.6 92.08,108.58
  Bottom 0.406: v41.27,84.77 33.66,92.39 v33.66,93.34 | v28.57,109.22 28.57,116.84 R308.2 | v81.92,63.5 81.92,70.48 v80.01,72.39
  Bottom 0.813: R308.2 OK304.3
MCU_DO0  (via drill 0.6)
  Top 0.406: v40.64,75.56 42.55,75.56 44.45,73.66 v76.83,73.66 | v30.48,81.92 v30.48,90.81 | v31.75,109.22 v31.75,112.39
  Bottom 0.406: IC501.P1.36 78.11,72.39 v76.83,73.66 | v30.48,81.92 34.29,81.92 v40.64,75.56 | v30.48,90.81 30.48,101.28 31.75,102.55 31.75,107.63 v31.75,109.22 | v31.75,112.39 35.56,116.2 38.73,116.2 39.37,116.84 R301.1
MCU_EN  (via drill 0.6)
  Top 0.406: v40.64,71.75 75.56,71.75 v76.83,70.48 | v27.3,81.92 v27.3,90.81 | v19.68,90.81 v19.68,113.67
  Bottom 0.254: v76.83,70.48 76.83,60.33
  Bottom 0.406: 76.83,60.33 IC501.P1.35 | v27.3,81.92 27.3,80.64 31.11,76.83 35.56,76.83 v40.64,71.75 | v27.3,90.81 v19.68,90.81 | v19.68,113.67 R304.2
  Bottom 0.813: R304.2 OK302.3
MCU_EN_POWER_STAGE
  Bottom 0.254: 83.82,82.55 83.82,86.14
  Bottom 0.406: 83.82,86.14 R701.2 81.92,87 81.28,86.36 IC702.1 | 83.82,82.55 85.72,80.64 IC501.P1.42
MCU_STEP  (via drill 0.6)
  Top 0.406: IC501.P2.47 93.34,108.58 85.72,100.97 58.42,100.97 v53.34,95.89 | v33.66,95.89 25.4,104.14 v25.4,109.22
  Bottom 0.406: v25.4,109.22 R306.2 | v33.66,95.89 v53.34,95.89
  Bottom 0.813: R306.2 OK303.3
MCU_VBUS  (via drill 0.6)
  Top 0.406: 57.78,133.41 IC602.9 | 57.78,133.41 IC602.8 | v57.78,130.81 57.78,133.41
  Bottom 0.254: 62.23,118.75 62.23,120.65 60.96,121.92 60.96,126.87 60.2,127.64 58.42,127.64 57.78,128.27 v57.78,130.81
  Bottom 0.305: 62.23,118.75 56.52,113.03 56.52,94.3 49.53,87.31 49.53,71.75 46.35,68.58 46.35,60.96 45.72,60.33 43.81,60.33
  Bottom 0.406: IC501.P1.7 43.81,60.33
N$1  (via drill 3.3 pad 6.45)
  other vias: 95,155
N$2  (via drill 3.3 pad 6.45)
  other vias: 5,155
N$3  (via drill 0.6)
  Top 0.406: IC401.5 v40.01,20.95 | v38.73,39.37 38.73,40.01 37.62,41.12 R405.1
  Bottom 0.406: v38.73,39.37 38.73,31.75 40.01,30.48 v40.01,20.95
N$4
  Top 0.61: IC901.8 81.22,21.53 R901.1
N$5  (via drill 0.6)
  Top 0.254: JP701.2 97.16,50.16 98.42,51.44 98.42,71.75 95.89,74.3
  Top 0.406: 95.89,74.3 v84.45,74.3
  Bottom 0.406: IC702.2 81.28,85.09 81.92,84.45 R702.2 82.97,82.13 84.45,80.64 v84.45,74.3
N$6  (via drill 3.3 pad 6.45)
  other vias: 5,5
N$7  (via drill 3.3 pad 6.45)
  other vias: 95,5
N$8
  Bottom 0.813: IC501.P2.5 IC501.P2.6
N$9
  Bottom 0.813: IC501.P2.3 IC501.P2.4
N$10
  Bottom 0.813: D101.A 4.79,137.63 5.52,138.36 X101.P$1
N$11
  Top 0.61: IC801.7 62.23,18.41 62.87,17.78 64.14,17.78 JP801.2 66.19,15.24 R802.2 66.19,9.37 66.67,8.89 66.67,5.16 X801.P$3
N$12
  Top 0.406: IC601.10 R610.1
  Bottom 0.61: R610.1 R614.1
N$13
  Top 0.406: R604.2 91.44,138.43 C602.2 91.22,134.84 90.59,135.47 89.5,135.47 88.9,134.87 IC601.9
  Bottom 0.61: R604.2 R607.1
N$14  (via drill 0.6)
  Top 0.406: v78.11,81.28 v75.56,81.28 v69.22,81.28 v62.87,81.28 | v75.56,85.09 v64.77,85.09
  Bottom 0.254: v78.11,81.28 IC702.5 | v75.56,81.28 IC702.10 | v69.22,81.28 IC701.5 | v64.77,85.09 66.04,86.36
  Bottom 0.406: v78.11,81.28 78.11,83.19 78.74,83.82 | 78.74,83.82 IC702.3 | IC702.13 v75.56,85.09 77.47,85.09 78.74,83.82 | IC701.10 v62.87,81.28 | 66.04,86.36 IC701.1 | v64.77,85.09 IC701.13
N$15  (via drill 1.1 pad 1.93)
  other vias: 58.42,38.1
N$16
  Top 0.406: IC601.6 IC601.7 91.38,128.21 95.25,132.08 R607.2
N$17
  Top 0.406: R609.2 89.53,125.73 88.27,125.73 87.63,126.36 IC601.5
  Bottom 0.406: R609.2 91.44,125.09 91.76,125.42 C604.1
N$18
  Bottom 0.406: R603.1 88.9,121.28 R609.3
N$19
  Bottom 0.406: R609.1 93.98,121.28 R613.2
N$20
  Top 0.406: IC601.12 R608.1
  Bottom 0.406: R608.1 R612.1
N$21
  Top 0.406: R602.2 81.28,138.43 C601.2 81.5,134.84 82.13,135.47 83.22,135.47 83.82,134.87 IC601.13
  Bottom 0.61: R602.2 R605.1
N$22
  Bottom 0.406: R625.2 49.53,136.53 49.53,137.79 50.16,138.43 52.07,138.43 R621.2
  Bottom 0.813: R626.1 R625.2
N$23
  Top 0.406: R605.2 77.47,135.25 83.19,129.54 83.19,128.21 | IC601.1 83.19,128.21 | 83.19,128.21 IC601.2
N$24
  Top 0.406: R606.2 83.19,125.73 84.45,125.73 85.09,126.36 IC601.3
  Bottom 0.406: R606.2 81.28,125.09 80.96,125.42 C603.1
N$25
  Bottom 0.406: R601.1 83.82,121.28 R606.3
N$26
  Bottom 0.406: R606.1 78.74,121.28 R611.2
N$28  (via drill 1.1 pad 1.93)
  other vias: 60.96,38.1
N$29
  Top 0.406: IC501.P2.45 90.81,108.58 84.45,102.23 57.15,102.23 37.47,82.55 37.47,76.83 22.23,61.59 S501.9
  Bottom 0.406: R508.1 S501.9
N$30
  Top 0.406: IC501.P2.43 88.27,108.58 83.19,103.5 55.88,103.5 36.2,83.82 36.2,78.11 17.14,59.05 S501.11
  Bottom 0.406: R506.1 S501.11
N$31
  Top 0.61: R803.2 53.82,15.39 JP803.2
N$32
  Top 0.61: JP802.1 63.35,15.24 R802.1
N$33
  Top 0.61: IC801.6 60.96,18.41 60.33,17.78 JP802.2 | X801.P$2 61.59,13.34 60.33,14.61 JP802.2 | JP802.2 JP803.1
N$34  (via drill 1.1 pad 1.93)
  other vias: 63.5,38.1
N$35
  Top 0.254: 51.44,108.9 51.44,111.12
  Top 0.406: S501.16 4.45,52.7 33.02,81.28 33.02,87.63 51.44,106.05 51.44,108.9 | 51.44,111.12 IC501.P2.14
  Bottom 0.406: R501.1 S501.16
N$36  (via drill 1.1 pad 1.93)
  other vias: 66.04,38.1
N$37
  Top 0.61: X801.P$1 56.59,7.07 59.84,10.31 R804.2
N$38
  Top 0.61: JP801.1 69.22,18.26 R801.1
N$41  (via drill 1.1 pad 1.93)
  other vias: 68.58,38.1
N$42
  Bottom 0.813: OK301.3 R302.1
N$43
  Bottom 0.813: OK302.1 R303.2
N$44
  Bottom 0.813: OK303.1 R305.2
N$45
  Bottom 0.813: OK304.1 R307.2
N$46  (via drill 1.1 pad 1.93)
  other vias: 71.12,38.1
N$47
  Bottom 0.813: R301.2 OK301.1
N$48  (via drill 1.1 pad 1.93)
  other vias: 73.66,38.1
N$49  (via drill 1.1 pad 1.93)
  other vias: 76.2,38.1
N$50  (via drill 1.1 pad 1.93)
  other vias: 78.74,38.1
N$51  (via drill 1.1 pad 1.93)
  other vias: 81.28,38.1
N$52  (via drill 1.1 pad 1.93)
  other vias: 83.82,38.1
N$53  (via drill 1.1 pad 1.93)
  other vias: 55.88,38.1
N$54
  Top 0.406: IC602.12 R621.1
  Top 0.61: R621.1 R623.1
N$55
  Top 0.406: R616.2 49.53,138.43 C605.2 49.87,134.84 50.42,135.38 51.56,135.38 52.07,134.87 IC602.13
  Bottom 0.813: R616.2 R618.1
N$56
  Top 0.406: R618.2 47.5,135.38 47.5,129.03 48.32,128.21 IC602.1 IC602.2
N$57
  Top 0.406: R620.2 52.07,126.36 52.7,126.36 53.34,127 IC602.3
  Bottom 0.406: R620.2 49.53,125.09 49.21,125.42 C606.1
N$58
  Bottom 0.813: R615.1 50.8,122.56 R620.3
N$59
  Bottom 0.813: R622.2 48.26,122.56 R620.1
N$60  (via drill 0.6)
  Top 0.406: IC401.3 v37.47,20.95 | v37.47,39.37 36.2,40.64 29.84,40.64 28.42,42.06 R404.1
  Bottom 0.406: v37.47,20.95 v37.47,39.37
N$61  (via drill 0.6)
  Top 0.406: R406.2 86.21,43.66 v85.72,43.18 | v41.27,26.04 IC401.11
  Bottom 0.406: v85.72,43.18 83.19,40.64 46.35,40.64 45.09,39.37 45.09,35.56 41.27,31.75 v41.27,26.04
N$62  (via drill 0.6)
  Top 0.406: R418.2 74.78,43.66 v74.3,43.18 | v27.3,26.04 IC402.11
  Bottom 0.406: v74.3,43.18 72.39,41.27 33.66,41.27 32.38,40.01 32.38,35.56 27.3,30.48 v27.3,26.04
N$63  (via drill 0.6)
  Top 0.406: R416.2 69.06,43.66 v68.58,43.18 | v24.77,26.04 IC402.13
  Bottom 0.406: v68.58,43.18 67.94,42.55 32.38,42.55 29.21,39.37 29.21,37.47 24.77,33.02 v24.77,26.04
N$64  (via drill 0.6)
  Top 0.406: R417.1 80.49,43.66 v80.01,43.18 | IC402.5 v26.04,20.95
  Bottom 0.406: v80.01,43.18 78.74,44.45 73.66,44.45 71.12,41.91 33.02,41.91 30.48,39.37 30.48,34.92 26.04,30.48 v26.04,20.95
N$65  (via drill 1.1 pad 1.93)
  other vias: 59.05,46.35
N$66
  Top 0.406: IC602.10 R619.2
  Top 0.61: R619.2 R617.2
N$67
  Top 0.406: R628.2 58.42,124.46 55.88,127 IC602.5
  Bottom 0.61: C608.1 58.1,118.42 58.42,118.75 R628.2 R624.1
N$68
  Top 0.61: X901.P$3 81.83,9.32 84.45,11.94 84.45,15.62 83.44,16.64 81.94,16.64 R902.2 81.92,18.03 81.41,18.54 80.14,18.54 79.38,19.3 IC901.7
N$69
  Top 0.61: JP901.1 78.99,15.24 80.42,13.82 R902.1
N$70
  Top 0.61: JP901.2 75.56,16.76 78.11,19.3 IC901.6
  Bottom 0.61: JP901.2 75.56,10.03 76.83,8.76 X901.P$2
N$71
  Top 0.61: X901.P$1 71.83,10.75 72.39,11.3 R903.2
N$72
  Top 0.406: IC501.P2.27 67.94,107.31 65.41,104.78 54.61,104.78 34.92,85.09 34.92,79.38 12.06,56.52 S501.13
  Bottom 0.406: R504.1 S501.13
N$73  (via drill 1.1 pad 1.93)
  other vias: 61.59,46.35
N$74  (via drill 0.6)
  Top 0.406: S501.15 6.99,53.98 33.66,80.64 33.66,87 49.85,103.19 v51.44,103.19
  Bottom 0.254: 51.44,108.9 51.44,111.12
  Bottom 0.406: R502.1 S501.15 | v51.44,103.19 51.44,108.9 | 51.44,111.12 IC501.P2.16
N$75  (via drill 0.6)
  Top 0.406: S501.14 9.53,55.24 34.29,80.01 34.29,86.04 v50.16,101.92
  Bottom 0.406: R503.1 S501.14 | v50.16,101.92 IC501.P2.13
N$76
  Top 0.406: R627.2 59.69,124.08 57.15,126.62 IC602.6
  Bottom 0.406: C607.1 59.37,125.42 59.69,125.09 R627.2
N$77
  Top 0.254: 89.53,108.58 89.53,111.12
  Top 0.406: 89.53,108.58 83.82,102.87 56.52,102.87 36.83,83.19 36.83,77.47 19.68,60.33 S501.10 | 89.53,111.12 IC501.P2.46
  Bottom 0.406: R507.1 S501.10
N$78
  Top 0.254: 81.92,107.31 81.92,111.12
  Top 0.406: 81.92,111.12 IC501.P2.40 | 81.92,107.31 78.74,104.14 55.24,104.14 35.56,84.45 35.56,78.74 14.61,57.78 S501.12
  Bottom 0.406: R505.1 S501.12
N$79  (via drill 1.1 pad 1.93)
  other vias: 64.14,46.35
N$80  (via drill 1.1 pad 1.93)
  other vias: 46.35,46.35
N$81  (via drill 1.1 pad 1.93)
  other vias: 43.81,46.35
N$82  (via drill 1.1 pad 1.93)
  other vias: 2.54,68.58
N$83  (via drill 1.1 pad 1.93)
  other vias: 2.54,71.12
N$84  (via drill 1.1 pad 1.93)
  other vias: 2.54,73.66
N$85  (via drill 1.1 pad 1.93)
  other vias: 2.54,76.2
N$86  (via drill 1.1 pad 1.93)
  other vias: 2.54,78.74
N$87  (via drill 1.1 pad 1.93)
  other vias: 2.54,81.28
N$88  (via drill 1.1 pad 1.93)
  other vias: 2.54,83.82
N$89  (via drill 1.1 pad 1.93)
  other vias: 2.54,86.36
N$90  (via drill 1.1 pad 1.93)
  other vias: 2.54,88.9
N$91  (via drill 1.1 pad 1.93)
  other vias: 2.54,91.44
N$92  (via drill 1.1 pad 1.93)
  other vias: 2.54,93.98
N$93  (via drill 1.1 pad 1.93)
  other vias: 2.54,96.52
N$94  (via drill 1.1 pad 1.93)
  other vias: 2.54,99.06
N$95  (via drill 1.1 pad 1.93)
  other vias: 2.54,101.6
N$96  (via drill 1.1 pad 1.93)
  other vias: 2.54,104.14
N$97  (via drill 1.1 pad 1.93)
  other vias: 5.08,104.14
N$98  (via drill 1.1 pad 1.93)
  other vias: 5.08,101.6
N$99  (via drill 1.1 pad 1.93)
  other vias: 5.08,99.06
N$100  (via drill 1.1 pad 1.93)
  other vias: 5.08,96.52
N$101  (via drill 1.1 pad 1.93)
  other vias: 5.08,93.98
N$102  (via drill 1.1 pad 1.93)
  other vias: 5.08,91.44
N$103  (via drill 1.1 pad 1.93)
  other vias: 5.08,88.9
N$104  (via drill 1.1 pad 1.93)
  other vias: 5.08,86.36
N$105  (via drill 1.1 pad 1.93)
  other vias: 5.08,83.82
N$106  (via drill 1.1 pad 1.93)
  other vias: 5.08,81.28
N$107  (via drill 1.1 pad 1.93)
  other vias: 5.08,78.74
N$108  (via drill 1.1 pad 1.93)
  other vias: 5.08,76.2
N$109  (via drill 1.1 pad 1.93)
  other vias: 5.08,73.66
N$110  (via drill 1.1 pad 1.93)
  other vias: 5.08,71.12
N$111  (via drill 1.1 pad 1.93)
  other vias: 5.08,68.58
N$112  (via drill 1.1 pad 1.93)
  other vias: 2.54,106.68
N$113  (via drill 1.1 pad 1.93)
  other vias: 5.08,106.68
N$114  (via drill 1.1 pad 1.93)
  other vias: 5.08,66.04
N$115  (via drill 1.1 pad 1.93)
  other vias: 2.54,66.04
N$116  (via drill 1.1 pad 1.93)
  other vias: 2.54,63.5
N$117  (via drill 1.1 pad 1.93)
  other vias: 5.08,63.5
N$118  (via drill 1.1 pad 1.93)
  other vias: 55.88,35.56
N$119  (via drill 1.1 pad 1.93)
  other vias: 58.42,35.56
N$120  (via drill 1.1 pad 1.93)
  other vias: 60.96,35.56
N$121  (via drill 1.1 pad 1.93)
  other vias: 63.5,35.56
N$122  (via drill 1.1 pad 1.93)
  other vias: 66.04,35.56
N$123  (via drill 1.1 pad 1.93)
  other vias: 68.58,35.56
N$124  (via drill 1.1 pad 1.93)
  other vias: 71.12,35.56
N$125  (via drill 1.1 pad 1.93)
  other vias: 73.66,35.56
N$126  (via drill 1.1 pad 1.93)
  other vias: 76.2,35.56
N$127  (via drill 1.1 pad 1.93)
  other vias: 78.74,35.56
N$128  (via drill 1.1 pad 1.93)
  other vias: 81.28,35.56
N$129  (via drill 1.1 pad 1.93)
  other vias: 83.82,35.56
N$130  (via drill 1.1 pad 1.93)
  other vias: 40.64,66.04
N$131  (via drill 1.1 pad 1.93)
  other vias: 40.64,104.14
PWM1_H
  Bottom 0.61: SV101.18 74.3,140.97 R104.2
PWM1_L
  Bottom 0.61: SV101.24 66.67,140.97 R108.2
PWM1H  (via drill 0.6, 0.9 pad 1.02)
  Top 0.406: v74.3,128.91 v74.3,132.72 | v74.3,92.71 60.33,92.71 59.05,91.44 v59.05,82.55
  Bottom 0.254: v74.3,92.71 74.3,116.84
  Bottom 0.406: 74.3,116.84 v74.3,128.91 | v74.3,132.72 R104.1 | v59.05,82.55 IC701.11
PWM1L  (via drill 0.6, 0.9 pad 1.02)
  Top 0.406: v66.67,128.91 v66.67,132.72 | v65.41,95.25 61.28,95.25 58.42,92.39 58.42,83.5 57.78,82.87 57.78,80.01 v59.05,78.74
  Bottom 0.254: 66.67,116.84 66.67,109.22 65.41,107.95 v65.41,95.25
  Bottom 0.406: 66.67,116.84 v66.67,128.91 | v66.67,132.72 R108.1 | v59.05,78.74 IC701.8
PWM2_H
  Bottom 0.61: SV101.20 71.75,140.97 R106.2
PWM2_L
  Bottom 0.61: SV101.26 64.14,140.97 R109.2
PWM2H  (via drill 0.9 pad 1.02)
  Top 0.406: v71.75,128.91 v71.75,132.72
  Bottom 0.254: 69.85,80.01 70.48,80.64 70.48,92.71 69.85,93.34 69.85,93.98 71.75,95.89 71.75,116.84
  Bottom 0.406: 71.75,116.84 v71.75,128.91 | v71.75,132.72 R106.1 | IC701.6 69.85,80.01
PWM2L  (via drill 0.9 pad 1.02)
  Top 0.406: v64.14,128.91 v64.14,132.72
  Bottom 0.254: v64.14,128.91 66.04,127 66.04,114.94 64.14,113.03 64.14,90.81 64.77,90.17 67.94,90.17 69.22,88.9 69.22,84.45 68.58,83.82
  Bottom 0.406: v64.14,132.72 R109.1 | IC701.3 68.58,83.82
PWM3_H
  Bottom 0.61: SV101.22 69.22,140.97 R107.2
PWM3_L
  Bottom 0.61: SV101.28 61.59,140.97 R110.2
PWM3H  (via drill 0.6, 0.9 pad 1.02)
  Top 0.254: v72.39,95.25 v69.22,95.25
  Top 0.406: v69.22,128.91 v69.22,132.72
  Bottom 0.254: 72.39,82.55 71.75,83.19 71.75,92.71 72.39,93.34 | v69.22,95.25 69.22,116.84
  Bottom 0.406: 69.22,116.84 v69.22,128.91 | v69.22,132.72 R107.1 | 72.39,82.55 IC702.11 | 72.39,93.34 v72.39,95.25
PWM3L  (via drill 0.6, 0.9 pad 1.02)
  Top 0.406: v61.59,128.91 v61.59,132.72 | v71.12,93.98 v61.59,93.98
  Bottom 0.254: v61.59,128.91 65.41,125.09 65.41,116.84 61.59,113.03 v61.59,93.98 | 72.39,78.74 71.12,80.01 v71.12,93.98
  Bottom 0.406: v61.59,132.72 R110.1 | 72.39,78.74 IC702.8
RS485_DE  (via drill 0.6)
  Top 0.254: 60.96,30.48 v60.96,30.61
  Top 0.61: IC801.3 60.96,29.21 | IC801.2 62.23,29.21 60.96,29.21 | 60.96,29.21 60.96,30.48
  Bottom 0.254: 79.38,60.33 79.38,53.98 78.36,52.96 71.75,52.96 69.6,50.8 69.6,46.61 71.12,45.09 86.74,45.09 88.14,43.69 88.14,33.27 85.47,30.61 64.64,30.61 64.26,30.99 61.34,30.99 v60.96,30.61
  Bottom 0.406: 79.38,60.33 IC501.P1.38
RS485_RX  (via drill 0.6)
  Top 0.406: IC801.1 v63.5,29.59
  Bottom 0.254: 85.72,56.52 81.15,51.94 72.26,51.94 70.74,50.42 70.74,47.12 71.63,46.23 87.12,46.23 89.28,44.07 89.28,32.89 85.98,29.59 v63.5,29.59
  Bottom 0.406: 85.72,56.52 IC501.P1.41
RS485_TX  (via drill 0.6)
  Top 0.406: IC801.4 v59.69,30.1
  Bottom 0.254: 81.92,60.33 81.92,53.98 80.39,52.45 72.01,52.45 70.23,50.67 70.23,46.86 71.5,45.59 87,45.59 88.65,43.94 88.65,33.02 85.72,30.1 64.39,30.1 64.01,30.48 63.12,30.48 62.36,29.72 60.07,29.72 v59.69,30.1
  Bottom 0.406: 81.92,60.33 IC501.P1.40
STEP
  Bottom 0.813: X103.P$2 20.52,140.14 R305.1
TIM1_BKIN  (via drill 0.6)
  Top 0.406: v50.16,70.48 v74.3,70.48 | IC602.7 58.99,128.21 v59.69,128.91
  Bottom 0.254: v74.3,70.48 74.3,60.33 | 59.05,109.22 59.05,113.03 64.77,118.75 64.77,123.83 v59.69,128.91
  Bottom 0.305: 59.05,109.22 57.15,107.31 57.15,93.98 50.16,87 v50.16,70.48
  Bottom 0.406: 74.3,60.33 IC501.P1.33
TIM1_CH1
  Bottom 0.254: 66.67,60.33 66.67,72.39 64.14,74.93 64.14,82.55 62.87,83.82
  Bottom 0.406: IC501.P1.27 66.67,60.33 | 62.87,83.82 IC701.12
TIM1_CH1N
  Bottom 0.254: 65.41,72.39 63.5,74.3 63.5,78.74 62.23,80.01
  Bottom 0.406: IC501.P1.26 65.41,72.39 | 62.23,80.01 IC701.9
TIM1_CH2
  Bottom 0.254: 69.22,60.33 69.22,72.39 65.41,76.2 65.41,81.92 66.04,82.55
  Bottom 0.406: IC501.P1.29 69.22,60.33 | 66.04,82.55 IC701.4
TIM1_CH2N
  Bottom 0.254: 67.94,72.39 64.77,75.56 64.77,83.82 66.04,85.09
  Bottom 0.406: IC501.P1.28 67.94,72.39 | 66.04,85.09 IC701.2
TIM1_CH3
  Bottom 0.254: 71.75,60.33 71.75,72.39 76.83,77.47 76.83,83.19 76.2,83.82
  Bottom 0.406: IC501.P1.31 71.75,60.33 | 76.2,83.82 IC702.12
TIM1_CH3N
  Bottom 0.254: 70.48,72.39 75.56,77.47 75.56,79.38 74.93,80.01 | IC702.9 73.66,80.01
  Bottom 0.406: IC501.P1.30 70.48,72.39 | 74.93,80.01 IC702.9
U  (via drill 0.6)
  Top 0.61: R415.1 24.77,32.87 R421.1 24.28,31.27 23.5,30.48 IC402.14 v23.5,26.04
  Bottom 0.406: X102.5 30.17,8.96 28.07,6.86 28.07,4.7 27.43,4.06 22.61,4.06 20.95,5.71 20.95,10.16 23.5,12.7 23.5,19.05
  Bottom 0.61: 23.5,19.05 v23.5,26.04
U2RX
  Bottom 0.406: IC501.P1.13 50.16,53.98 51.44,52.7 SL501.2
U2TX
  Bottom 0.254: 51.44,57.78 51.44,60.33
  Bottom 0.406: 51.44,60.33 IC501.P1.14 | 51.44,57.78 51.44,55.24 53.98,52.7 SL501.3
U_OUT_TIM4_CH1  (via drill 0.6)
  Top 0.406: v71.75,49.53 71.44,49.21 C404.2 71.44,46.67 71.91,46.2 R416.1
  Bottom 0.254: 89.53,60.33 89.53,58.42 81.92,50.8 73.03,50.8
  Bottom 0.406: 89.53,60.33 IC501.P1.44 | v71.75,49.53 73.03,50.8
UN  (via drill 0.6)
  Top 0.61: R424.2 20.95,32.87 R421.2 21.44,31.27 22.23,30.48 IC402.15 v22.23,26.04
  Bottom 0.406: X102.13 29.45,3.92 28.83,3.3 21.46,3.3 20.32,4.45 20.32,11.43 22.23,13.34 22.23,19.05
  Bottom 0.61: 22.23,19.05 v22.23,26.04
V  (via drill 0.6)
  Top 0.61: R414.1 27.3,32.87 R420.1 27.79,31.27 28.57,30.48 IC402.10 v28.57,26.04
  Bottom 0.406: X102.6 28.07,10.54 31.11,14.86 31.11,26.67 30.48,27.3 29.21,27.3 28.57,26.67 v28.57,26.04
V_OUT_TIM4_CH2  (via drill 0.6)
  Top 0.406: v77.47,49.53 77.15,49.21 C406.1 77.15,46.67 77.62,46.2 R418.1
  Bottom 0.254: v77.47,49.53 81.53,49.53
  Bottom 0.406: 81.53,49.53 90.81,58.8 IC501.P1.45
VBUS  (via drill 0.6)
  Top 0.406: R617.1 59.69,138.43 v65.41,138.43 | SV101.6 81.92,142.24 79.38,142.24 78.74,141.6 78.74,139.06 78.11,138.43 v70.48,138.43
  Bottom 0.406: v65.41,138.43 v70.48,138.43
VN  (via drill 0.6)
  Top 0.61: R423.2 31.11,32.87 R420.2 30.63,31.27 29.84,30.48 IC402.9 v29.84,26.04
  Bottom 0.406: v29.84,26.04 29.84,15.88 26.68,11.44 X102.14
W
  Top 0.406: R413.1 27.09,16.09 27.3,15.88 27.3,13.34 25.3,11.33 X102.7
  Top 0.61: R413.1 26.04,17.93 R419.1 26.52,19.53 27.3,20.32 IC402.6
W_OUT_TIM4_CH3  (via drill 0.6)
  Top 0.406: v83.19,49.53 82.86,49.21 C405.1 82.86,46.67 83.34,46.2 R417.2
  Bottom 0.254: 92.08,60.33 92.08,58.42 87.63,53.98
  Bottom 0.406: 92.08,60.33 IC501.P1.46 | v83.19,49.53 87.63,53.98
WN
  Top 0.406: X102.15 24.53,6.12 26.67,8.26 26.67,10.79 28.57,12.7 28.57,15.88 28.79,16.09 R422.2
  Top 0.61: R422.2 29.84,17.93 R419.2 29.36,19.53 28.57,20.32 IC402.7
Z  (via drill 0.6)
  Top 0.61: R403.1 41.27,32.87 R409.1 41.76,31.27 42.55,30.48 IC401.10 v42.55,26.04
  Bottom 0.406: X102.3 36.37,5.28 37.08,4.57 42.67,4.57 43.43,5.33 43.43,13.72 42.55,14.61 v42.55,26.04
Z_OUT_TIM4_CH4  (via drill 0.6)
  Top 0.406: v88.9,49.53 88.58,49.21 C403.1 88.58,46.67 89.05,46.2 R406.1
  Bottom 0.406: IC501.P1.47 93.34,53.98 v88.9,49.53
ZN  (via drill 0.6)
  Top 0.61: R412.2 45.09,32.87 R409.2 44.6,31.27 43.81,30.48 IC401.9 v43.81,26.04
  Bottom 0.406: X102.11 34.99,5.14 36.45,3.81 43.05,3.81 44.45,5.21 44.45,13.97 43.81,14.61 v43.81,26.04

## Text on the board
Top: TOP | 24.02.2019
Bottom: 24.02.2019